# EAGLE schematic Att Test (EAGLE 8.3.1)
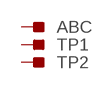
[diagram p0: schematic, sheet 1]

## Parts
ABC  TPS-PAD-1MM  [PAD-1MM-BRD]
TP1  TPS-PAD-1MM  [PAD-1MM-BRD]
TP2  TPS-PAD-1MM  [PAD-1MM-BRD]
Unconnected: ABC.1(TP) TP1.1(TP) TP2.1(TP)

## Library data of the parts
ABC = TEST:TPS: TEST POINT PAD; BOM: EXCLUDE
TP1 = TEST:TPS: TEST POINT PAD; ATT1: Defined1; BOM: EXCLUDE
TP2 = TEST:TPS: TEST POINT PAD; ATT1: Defined1; ATT3: att3; BOM: EXCLUDE